# EAGLE design re design main board (EAGLE 7.7.0)
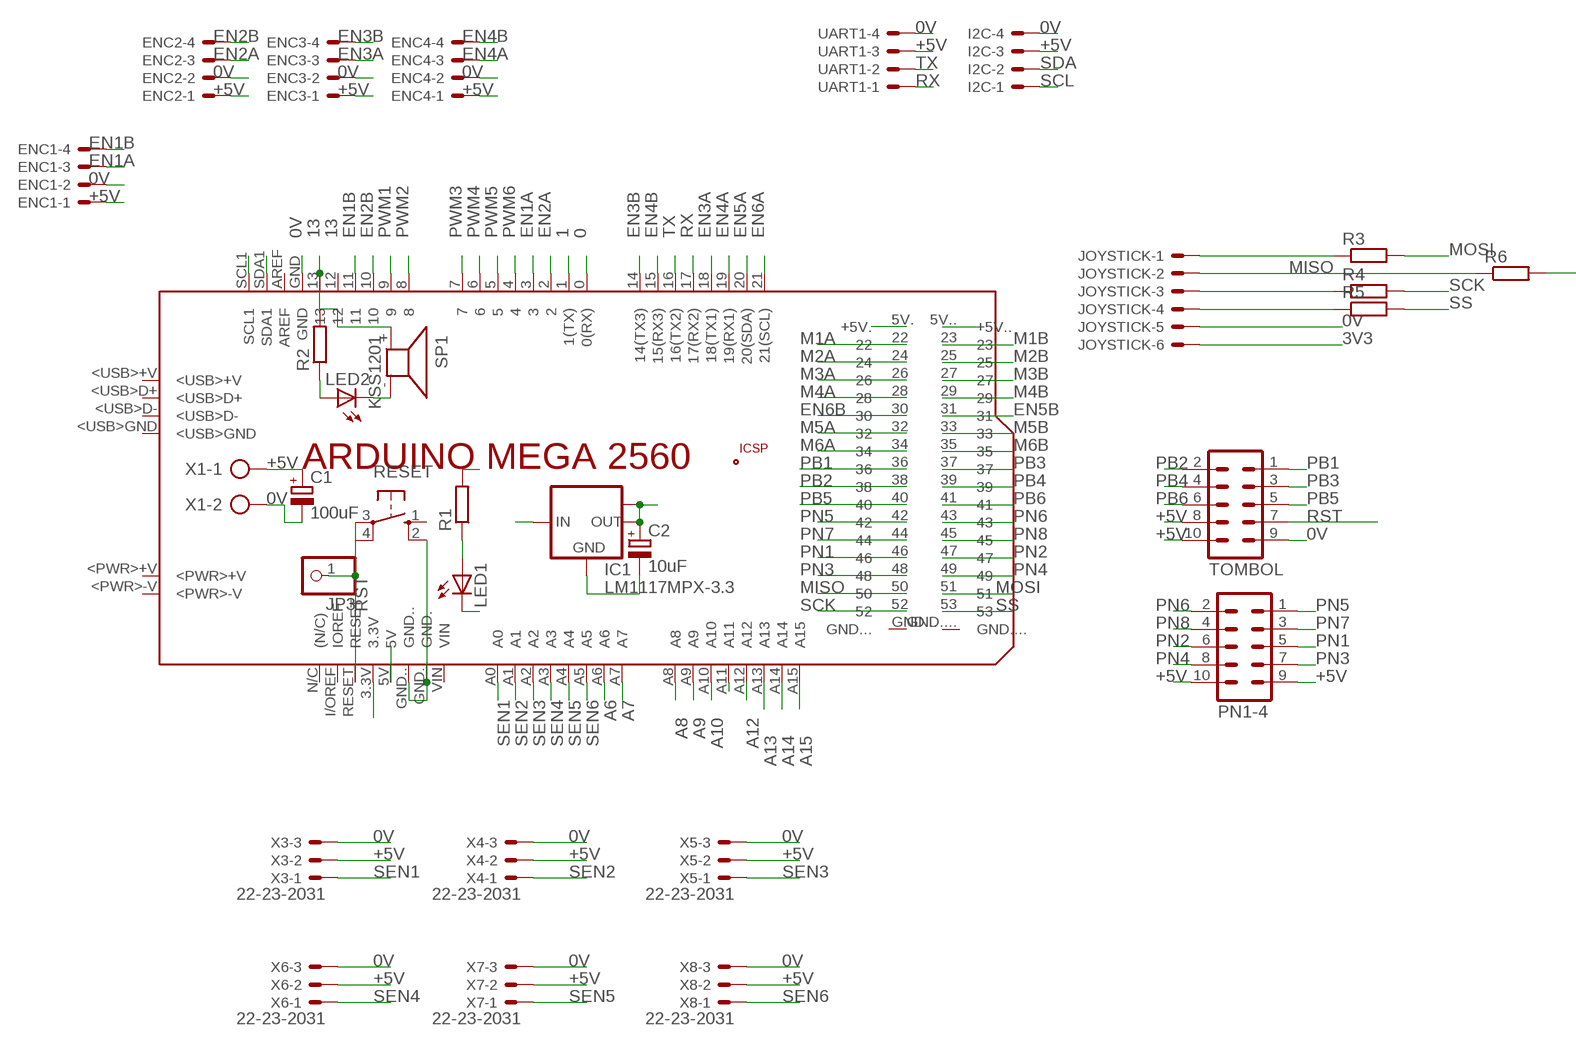
[diagram p0: schematic, sheet 1, part 1 of 2]
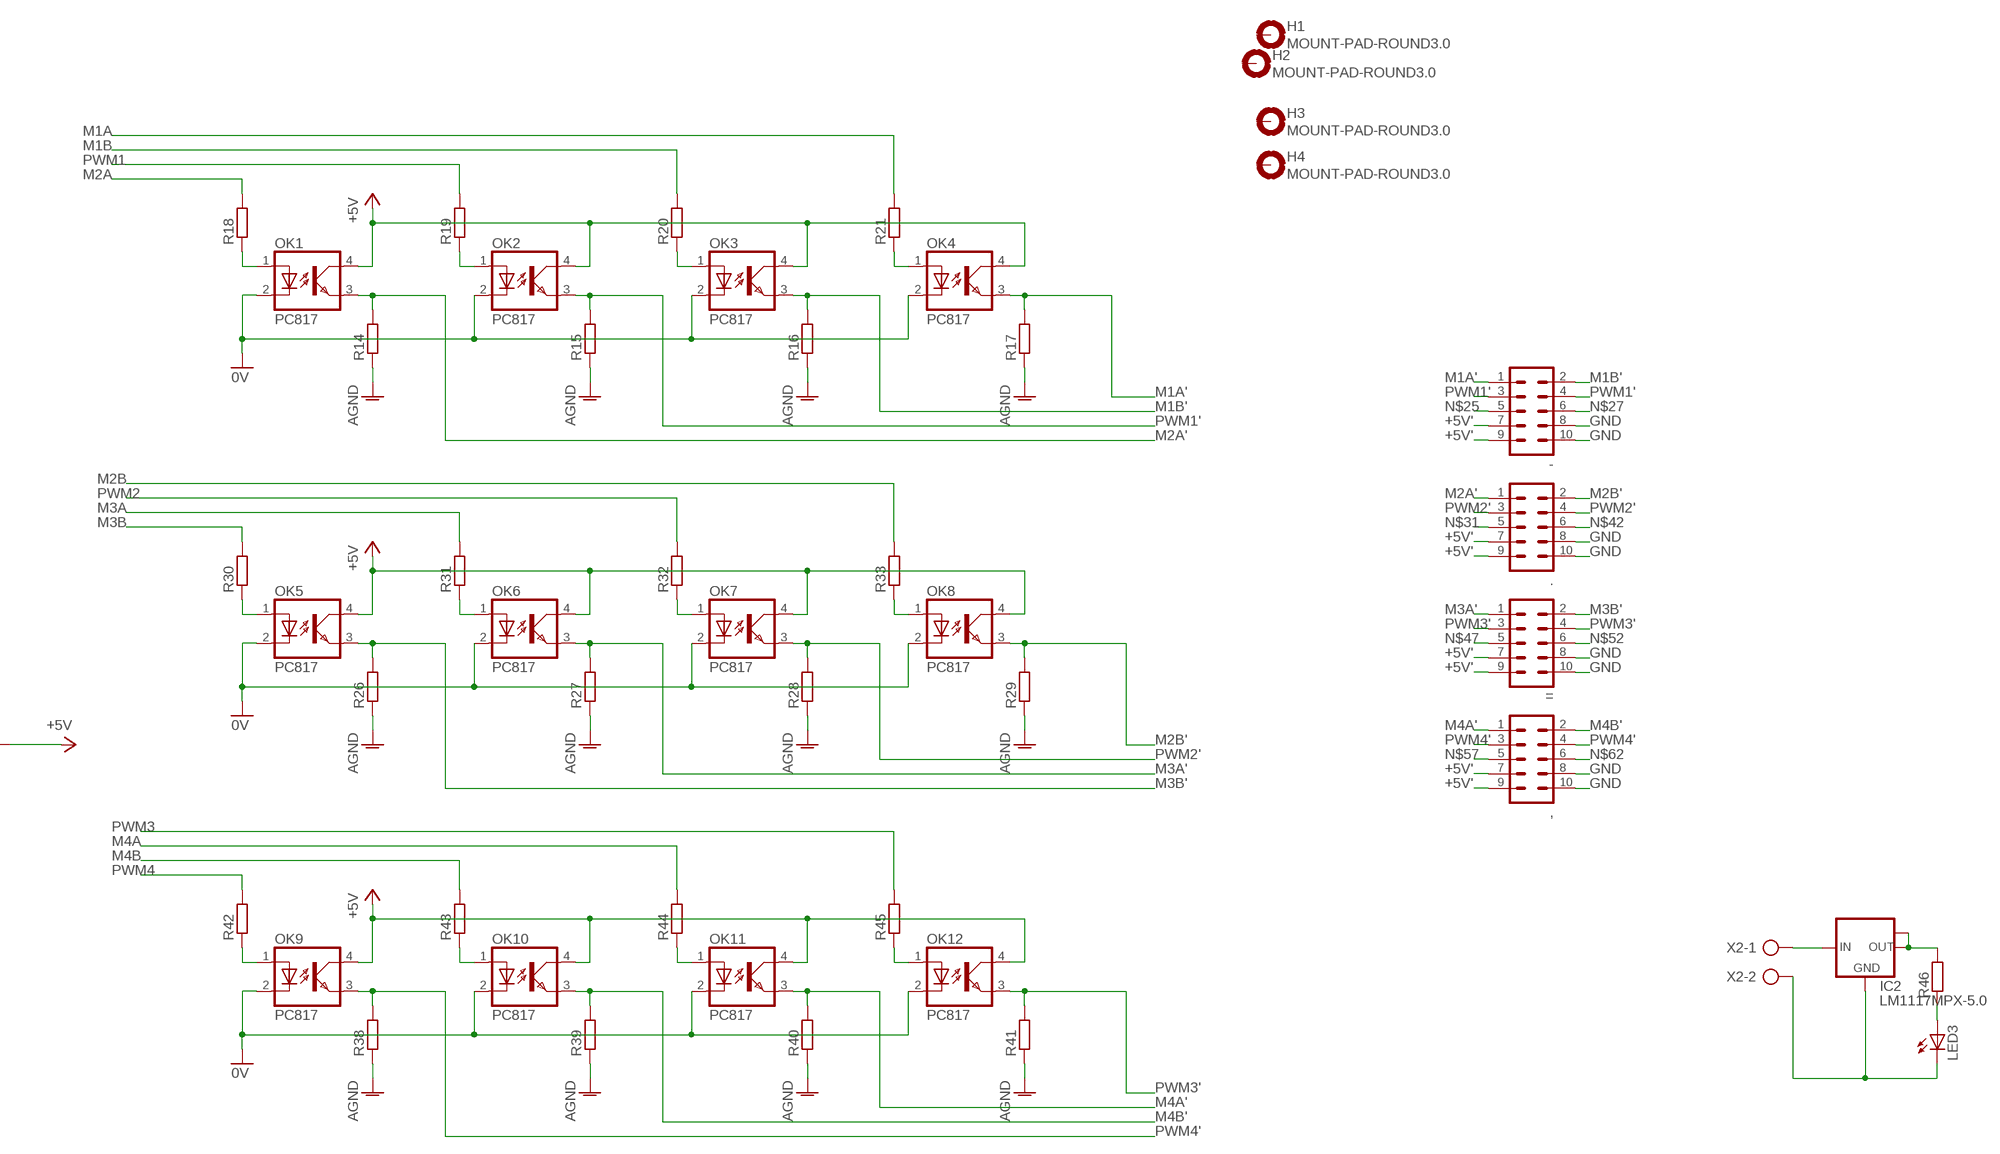
[diagram p1: schematic, sheet 1, part 2 of 2]

## Parts
,  ML10  [ML10]
-  ML10  [ML10]
.  ML10  [ML10]
=  ML10  [ML10]
C1  100uF  CPOL-EUE2.5-5  [E2,5-5]
C2  10uF  CPOL-EUE2.5-5  [E2,5-5]
ENC1  22-23-2041  [22-23-2041]
ENC2  22-23-2041  [22-23-2041]
ENC3  22-23-2041  [22-23-2041]
ENC4  22-23-2041  [22-23-2041]
H1  MOUNT-PAD-ROUND3.0  [3,0-PAD]
H2  MOUNT-PAD-ROUND3.0  [3,0-PAD]
H3  MOUNT-PAD-ROUND3.0  [3,0-PAD]
H4  MOUNT-PAD-ROUND3.0  [3,0-PAD]
I2C  22-23-2041  [22-23-2041]
IC1  LM1117MPX-3.3  [SOT223]
IC2  LM1117MPX-5.0  [SOT223]
JOYSTICK  22-23-2061  [22-23-2061]
JP3  PINHD-1X1  [1X01]
LED1  LED3MM  [LED3MM]
LED2  LED3MM  [LED3MM]
LED3  LED3MM  [LED3MM]
OK1  PC817  [DIL04]
OK2  PC817  [DIL04]
OK3  PC817  [DIL04]
OK4  PC817  [DIL04]
OK5  PC817  [DIL04]
OK6  PC817  [DIL04]
OK7  PC817  [DIL04]
OK8  PC817  [DIL04]
OK9  PC817  [DIL04]
OK10  PC817  [DIL04]
OK11  PC817  [DIL04]
OK12  PC817  [DIL04]
PCB1  ARDUINO_MEGA2560  [ARDUINO_MEGA2560]
PN1-4  ML10  [ML10]
R1  R-EU_M0805  [M0805]
R2  R-EU_M0805  [M0805]
R3  R-EU_R0805  [R0805]
R4  R-EU_R0805  [R0805]
R5  R-EU_R0805  [R0805]
R6  R-EU_R0805  [R0805]
R14  R-EU_M0805  [M0805]
R15  R-EU_M0805  [M0805]
R16  R-EU_M0805  [M0805]
R17  R-EU_M0805  [M0805]
R18  R-EU_M0805  [M0805]
R19  R-EU_M0805  [M0805]
R20  R-EU_M0805  [M0805]
R21  R-EU_M0805  [M0805]
R26  R-EU_M0805  [M0805]
R27  R-EU_M0805  [M0805]
R28  R-EU_M0805  [M0805]
R29  R-EU_M0805  [M0805]
R30  R-EU_M0805  [M0805]
R31  R-EU_M0805  [M0805]
R32  R-EU_M0805  [M0805]
R33  R-EU_M0805  [M0805]
R38  R-EU_M0805  [M0805]
R39  R-EU_M0805  [M0805]
R40  R-EU_M0805  [M0805]
R41  R-EU_M0805  [M0805]
R42  R-EU_M0805  [M0805]
R43  R-EU_M0805  [M0805]
R44  R-EU_M0805  [M0805]
R45  R-EU_M0805  [M0805]
R46  R-EU_0207/10  [0207/10]
RESET  40-XX  [B3F-40XX]
SP1  KSS1201  [KSS1201]
TOMBOL  ML10  [ML10]
UART1  22-23-2041  [22-23-2041]
X1  AK500/2  [AK500/2]
X2  AK300/2  [AK300/2]
X3  22-23-2031  [22-23-2031]
X4  22-23-2031  [22-23-2031]
X5  22-23-2031  [22-23-2031]
X6  22-23-2031  [22-23-2031]
X7  22-23-2031  [22-23-2031]
X8  22-23-2031  [22-23-2031]

## Nets
0: PCB1.0(0(RX))
0V: C1.- ENC1.2 ENC2.2 ENC3.2 ENC4.2 I2C.4 JOYSTICK.5 LED1.K(C) LED2.K(C) OK1.2(C) OK2.2(C) OK3.2(C) OK4.2(C) OK5.2(C) OK6.2(C) OK7.2(C) OK8.2(C) OK9.2(C) OK10.2(C) OK11.2(C) OK12.2(C) PCB1.GND PCB1.GND. PCB1.GND.. RESET.2(S1) SP1.- TOMBOL.9 UART1.4 X1.2 X3.3 X4.3 X5.3 X6.3 X7.3 X8.3
1: PCB1.1(1(TX))
3V3: C2.+ IC1.2(OUT) IC1.TAB(OUT1) JOYSTICK.6 PCB1.3.3V
13: PCB1.13 R2.2 SP1.+
+5V: C1.+ ENC1.1 ENC2.1 ENC3.1 ENC4.1 I2C.3 IC1.3(IN) PCB1.5V PCB1.5V.(+5V.) PCB1.5V..(+5V..) PN1-4.9 PN1-4.10 R1.2 R6.2 TOMBOL.8 TOMBOL.10 UART1.3 X1.1 X3.2 X4.2 X5.2 X6.2 X7.2 X8.2
+5V': ,.7 ,.9 -.7 -.9 ..7 ..9 =.7 =.9 IC2.2(OUT) IC2.TAB(OUT1) OK1.4(COL) OK2.4(COL) OK3.4(COL) OK4.4(COL) OK5.4(COL) OK6.4(COL) OK7.4(COL) OK8.4(COL) OK9.4(COL) OK10.4(COL) OK11.4(COL) OK12.4(COL) R46.2 ; supply symbol labelled +5V
A6: PCB1.A6
A7: PCB1.A7
A8: PCB1.A8
A9: PCB1.A9
A10: PCB1.A10
A11: PCB1.A11
A12: PCB1.A12
A13: PCB1.A13
A14: PCB1.A14
A15: PCB1.A15
EN1A: ENC1.3 PCB1.3
EN1B: ENC1.4 PCB1.11
EN2A: ENC2.3 PCB1.2
EN2B: ENC2.4 PCB1.10
EN3A: ENC3.3 PCB1.18(18(TX1))
EN3B: ENC3.4 PCB1.14(14(TX3))
EN4A: ENC4.3 PCB1.19(19(RX1))
EN4B: ENC4.4 PCB1.15(15(RX3))
EN5A: PCB1.20(20(SDA))
EN5B: PCB1.31
EN6A: PCB1.21(21(SCL))
EN6B: PCB1.30
GND: ,.8 ,.10 -.8 -.10 ..8 ..10 =.8 =.10 IC2.1(GND) LED3.K(C) R14.1 R15.1 R16.1 R17.1 R26.1 R27.1 R28.1 R29.1 R38.1 R39.1 R40.1 R41.1 X2.2 ; supply symbol labelled AGND
M1A: PCB1.22 R21.2
M1A': -.1 OK4.3(EMIT) R17.2
M1B: PCB1.23 R20.2
M1B': -.2 OK3.3(EMIT) R16.2
M2A: PCB1.24 R18.2
M2A': ..1 OK1.3(EMIT) R14.2
M2B: PCB1.25 R33.2
M2B': ..2 OK8.3(EMIT) R29.2
M3A: PCB1.26 R31.2
M3A': =.1 OK6.3(EMIT) R27.2
M3B: PCB1.27 R30.2
M3B': =.2 OK5.3(EMIT) R26.2
M4A: PCB1.28 R44.2
M4A': ,.1 OK11.3(EMIT) R40.2
M4B: PCB1.29 R43.2
M4B': ,.2 OK10.3(EMIT) R39.2
M5A: PCB1.32
M5B: PCB1.33
M6A: PCB1.34
M6B: PCB1.35
MISO: JOYSTICK.2 PCB1.50 R6.1
MOSI: PCB1.51 R3.2
N$3: LED1.A R1.1
N$4: LED2.A R2.1
N$6: C2.- IC1.1(GND)
N$9: OK1.1(A) R18.1
N$10: OK2.1(A) R19.1
N$11: OK3.1(A) R20.1
N$12: OK4.1(A) R21.1
N$18: OK5.1(A) R30.1
N$19: OK6.1(A) R31.1
N$20: OK7.1(A) R32.1
N$21: OK8.1(A) R33.1
N$23: JOYSTICK.1 R3.1
N$25: -.5
N$26: JOYSTICK.3 R4.1
N$27: -.6
N$28: JOYSTICK.4 R5.1
N$29: LED3.A R46.1
N$30: IC2.3(IN) X2.1
N$31: ..5
N$37: OK9.1(A) R42.1
N$38: OK10.1(A) R43.1
N$39: OK11.1(A) R44.1
N$40: OK12.1(A) R45.1
N$42: ..6
N$47: =.5
N$52: =.6
N$57: ,.5
N$62: ,.6
PB1: PCB1.36 TOMBOL.1
PB2: PCB1.38 TOMBOL.2
PB3: PCB1.37 TOMBOL.3
PB4: PCB1.39 TOMBOL.4
PB5: PCB1.40 TOMBOL.5
PB6: PCB1.41 TOMBOL.6
PN1: PCB1.46 PN1-4.5
PN2: PCB1.47 PN1-4.6
PN3: PCB1.48 PN1-4.7
PN4: PCB1.49 PN1-4.8
PN5: PCB1.42 PN1-4.1
PN6: PCB1.43 PN1-4.2
PN7: PCB1.44 PN1-4.3
PN8: PCB1.45 PN1-4.4
PWM1: PCB1.9 R19.2
PWM1': -.3 -.4 OK2.3(EMIT) R15.2
PWM2: PCB1.8 R32.2
PWM2': ..3 ..4 OK7.3(EMIT) R28.2
PWM3: PCB1.7 R45.2
PWM3': =.3 =.4 OK12.3(EMIT) R41.2
PWM4: PCB1.6 R42.2
PWM4': ,.3 ,.4 OK9.3(EMIT) R38.2
PWM5: PCB1.5
PWM6: PCB1.4
RST: JP3.1 PCB1.RESET RESET.3(P) TOMBOL.7
RX: PCB1.17(17(RX2)) UART1.1
SCK: PCB1.52 R4.2
SCL: I2C.1 PCB1.SCL1
SDA: I2C.2 PCB1.SDA1
SEN1: PCB1.A0 X3.1
SEN2: PCB1.A1 X4.1
SEN3: PCB1.A2 X5.1
SEN4: PCB1.A3 X6.1
SEN5: PCB1.A4 X7.1
SEN6: PCB1.A5 X8.1
SS: PCB1.53 R5.2
TX: PCB1.16(16(TX2)) UART1.2
Unconnected: H1.B3,0(MOUNT) H2.B3,0(MOUNT) H3.B3,0(MOUNT) H4.B3,0(MOUNT) PCB1.12 PCB1.<PWR>+V PCB1.<PWR>-V PCB1.<USB>+V PCB1.<USB>D+ PCB1.<USB>D- PCB1.<USB>GND PCB1.AREF PCB1.GND... PCB1.GND.... PCB1.I/OREF(IOREF) PCB1.N/C((N/C)) PCB1.VIN RESET.1(S) RESET.4(P1)

## Library data of the parts
, - . = PN1-4 TOMBOL = con-harting-ml:ML10: HARTING; OC_FARNELL: unknown; OC_NEWARK: unknown
C1 C2 = rcl:CPOL-EU: POLARIZED CAPACITOR, European symbol
ENC1-ENC4 I2C UART1 = con-molex:22-23-2041: .100" (2.54mm) Center Header - 4 Pin; MF: MOLEX; MPN: 22-23-2041; OC_FARNELL: 1462920; OC_NEWARK: 38C0355
H1-H4 = holes:MOUNT-PAD-ROUND: MOUNTING PAD, round
IC1 IC2 = lm1117:LM1117MPX-*
JOYSTICK = con-molex:22-23-2061: .100" (2.54mm) Center Header - 6 Pin; MF: MOLEX; MPN: 22-23-2061; OC_FARNELL: 1462922; OC_NEWARK: 27C1933
JP3 = pinhead:PINHD-1X1: PIN HEADER
LED1-LED3 = led:LED: LED OSRAM: - CHIPLED LG R971, LG N971, LY N971, LG Q971, LY Q971, LO R971, LY R971 LH N974, LH R974 LS Q976, LO Q976, LY Q976 LO Q996 - Hyper CHIPLED LW Q18S LB Q993, LB Q99A, LB R99A - SideLED LS A670, LO A670, LY A670, LG A670, LP A670 LB A673, LV A673, LT A673, LW A673 LH A674 LY A675 LS A676, LA A676, LO A676, LY A676, LW A676 LS A679, LY A679, LG A679 - Hyper Micro SIDELED® LS Y876, LA Y876, LO Y876, LY Y876 LT Y87S - SmartLED LW L88C, LW L88S LB L89C, LB L89S, LG L890 LS L89K, LO L89K, LY L89K LS L896, LA L896, LO L896, LY L896 - TOPLED LS T670, LO T670, LY T670, LG T670, LP T670 LSG T670, LSP T670, LSY T670, LOP T670, LYG T670 LG T671, LOG T671, LSG T671 LB T673, LV T673, LT T673, LW T673 LH T674 LS T676, LA T676, LO T676, LY T676, LB T676, LH T676, LSB T676, LW T676 LB T67C, LV T67C, LT T67C, LS T67K, LO T67K, LY T67K, LW E67C LS E67B, LA E67B, LO E67B, LY E67B, LB E67C, LV E67C, LT E67C LW T67C LS T679, LY T679, LG T679 LS T770, LO T770, LY T770, LG T770, LP T770 LB T773, LV T773, LT T773, LW T773 LH T774 LS E675, LA E675, LY E675, LS T675 LS T776, LA T776, LO T776, LY T776, LB T776 LHGB T686 LT T68C, LB T68C - Hyper Mini TOPLED® LB M676 - Mini TOPLED Santana® LG M470 LS M47K, LO M47K, LY M47K Source: http://www.osram.convergy.de LUXEON: - LUMILED® LXK2-PW12-R00, LXK2-PW12-S00, LXK2-PW14-U00, LXK2-PW14-V00 LXK2-PM12-R00, LXK2-PM12-S00, LXK2-PM14-U00 LXK2-PE12-Q00, LXK2-PE12-R00, LXK2-PE12-S00, LXK2-PE14-T00, LXK2-PE14-U00 LXK2-PB12-K00, LXK2-PB12-L00, LXK2-PB12-M00, LXK2-PB14-N00, LXK2-PB14-P00, LXK2-PB14-Q00 LXK2-PR12-L00, LXK2-PR12-M00, LXK2-PR14-Q00, LXK2-PR14-R00 LXK2-PD12-Q00, LXK2-PD12-R00, LXK2-PD12-S00 LXK2-PH12-R00, LXK2-PH12-S00 LXK2-PL12-P00, LXK2-PL12-Q00, LXK2-PL12-R00 Source: www.luxeon.com KINGBRIGHT: KA-3528ASYC Source: www.kingbright.com
OK1-OK12 = optocoupler:PC817: SHARP OPTO COUPLER; MPN: PC817X4J000F; OC_FARNELL: 9707727; OC_NEWARK: 97K7059
PCB1 = Arduino:ARDUINO_MEGA2560: Device for representing an Arduino Mega 2560 board with a footprint in an EAGLE design. Created by Dave Young for Element14. More EAGLE documentation at: http://www.element14.com/community/community/knode/cadsoft_eagle
R1-R6 R14-R21 R26-R33 R38-R46 = rcl:R-EU_: RESISTOR, European symbol
RESET = switch-omron:40-XX: OMRON SWITCH; MF: OMRON COMPONENTS USA; MPN: B3F-4000; OC_FARNELL: 176434; OC_NEWARK: 36K3105
SP1 = buzzer:KSS1201: SPEAKER Source: Schukat; OC_FARNELL: unknown; OC_NEWARK: unknown
X1 = con-ptr500:AK500/2: CONNECTOR; OC_FARNELL: unknown; OC_NEWARK: unknown
X2 = con-ptr500:AK300/2: CONNECTOR; OC_FARNELL: unknown; OC_NEWARK: unknown
X3-X8 = con-molex:22-23-2031: .100" (2.54mm) Center Header - 3 Pin; MF: MOLEX; MPN: 22-23-2031; OC_FARNELL: 1462950; OC_NEWARK: 30C0862

## Board
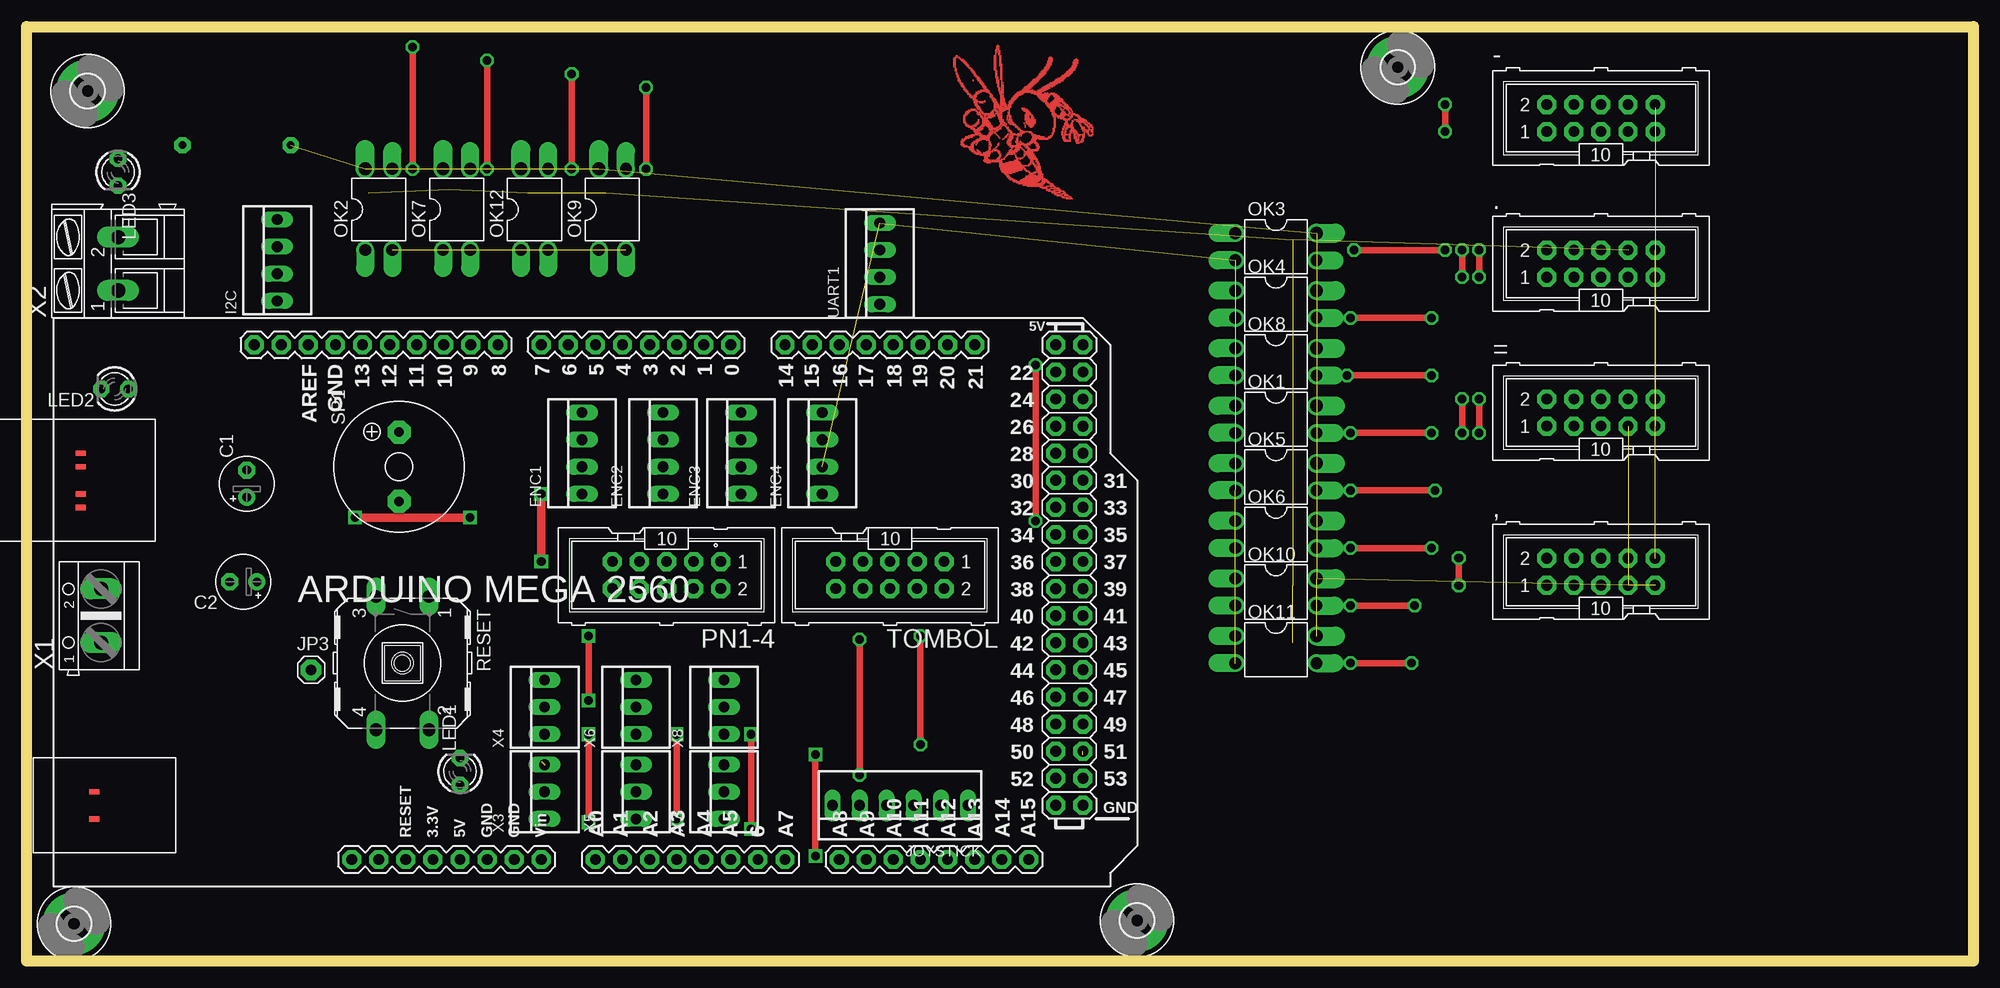
[diagram p2: board, top side]
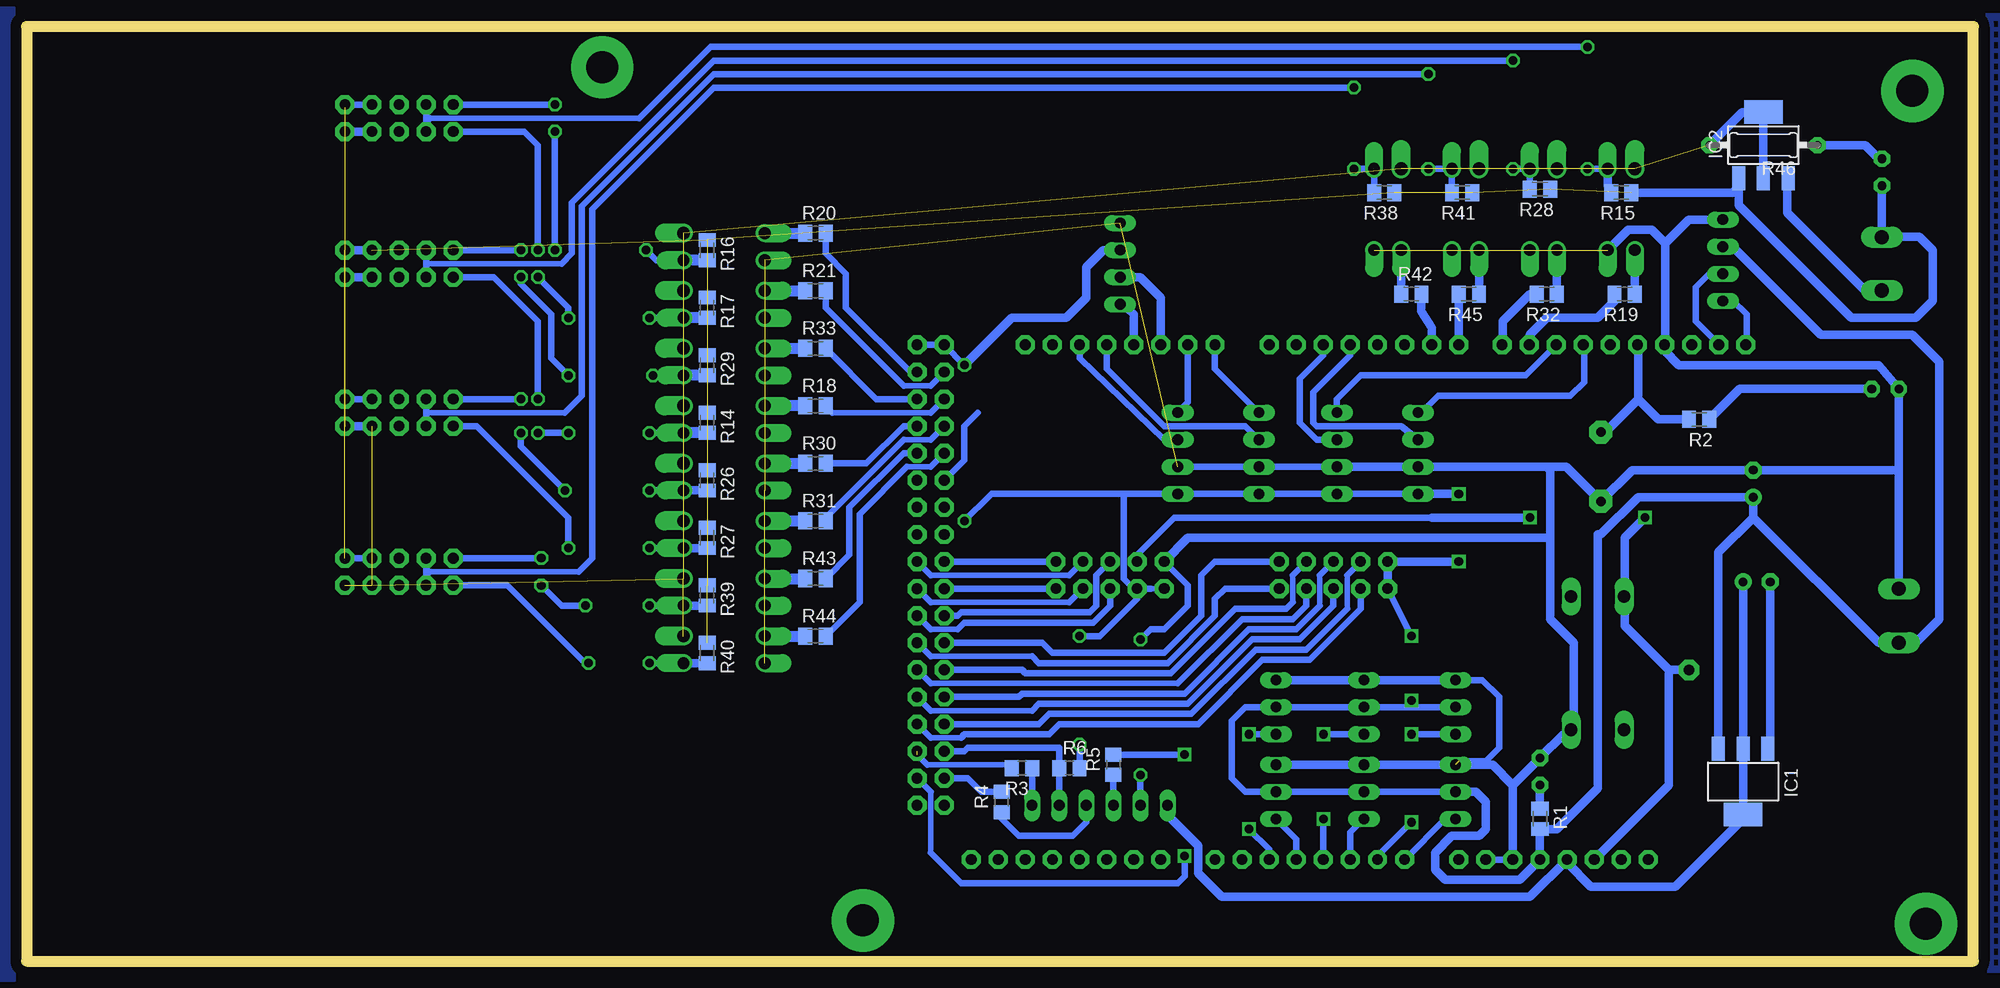
[diagram p3: board, bottom side, seen from below]

Size 182.56 x 87.63 mm. Coordinates in mm from the lower left corner, seen from the top.
Outline: 0,87.63 182.56,87.63 182.56,0 0,0 0,87.63
Copper layers (1*16): Top 0.035mm / dielectric 1.5mm / Bottom 0.035mm
Design rules "default": minimum track width 10mil, minimum drill 24mil, track to track 8mil, track to pad 8mil, pad to pad 8mil, via to via 8mil, smd to smd 8mil, copper to edge 40mil, drill to drill 8mil, minimum pad ring 10mil, minimum via ring 8mil, stop-mask expansion 4mil, vias tented up to drill 0mil, thermal gap 10mil

### Footprints (pad centres in the part's own frame; a part is rotated, then mirrored left to right if it is on the bottom)
ML10 = drill 1 pad 1.778 octagon: 1 -5.08,-1.27; 2 -5.08,1.27; 3 -2.54,-1.27; 4 -2.54,1.27; 5 0,-1.27; 6 0,1.27; 7 2.54,-1.27; 8 2.54,1.27; 9 5.08,-1.27; 10 5.08,1.27
E2,5-5 = drill 0.813 pad 1.6: + -1.27,0 | drill 0.813 pad 1.6 octagon: - 1.27,0
22-23-2041 = drill 1 long: 1 -3.81,0; 2 -1.27,0; 3 1.27,0; 4 3.81,0
3,0-PAD = drill 3 pad 5.842: B3,0 0,0
SOT223 = smd 1.219 x 2.235: 1 -2.311,-3.099; 2 0,-3.099; 3 2.311,-3.099 | smd 3.6 x 2.2: TAB 0,3.099
22-23-2061 = drill 1 long: 1 -6.35,0; 2 -3.81,0; 3 -1.27,0; 4 1.27,0; 5 3.81,0; 6 6.35,0
1X01 = drill 1 pad 1.93 octagon: 1 0,0
LED3MM = drill 0.813 pad 1.524 octagon: A -1.27,0; K 1.27,0
DIL04 = drill 1.1 pad 1.676 offset: 1 -1.27,-3.81; 2 1.27,-3.81; 3 1.27,3.81 | drill 1.2 pad 1.676 offset: 4 -1.27,3.81
ARDUINO_MEGA2560 = drill 1.016 pad 1.778 octagon: 0 63.5,50.8; 1 60.96,50.8; 2 58.42,50.8; 3 55.88,50.8; 3.3V 35.56,2.54; 4 53.34,50.8; 5 50.8,50.8; 5V 38.1,2.54; 5V. 93.98,50.8; 5V.. 96.52,50.8; 6 48.26,50.8; 7 45.72,50.8; 8 41.656,50.8; 9 39.116,50.8; 10 36.576,50.8; 11 34.036,50.8; 12 31.496,50.8; 13 28.956,50.8; 14 68.58,50.8; 15 71.12,50.8; 16 73.66,50.8; 17 76.2,50.8; 18 78.74,50.8; 19 81.28,50.8; 20 83.82,50.8; 21 86.36,50.8; 22 93.98,48.26; 23 96.52,48.26; 24 93.98,45.72; 25 96.52,45.72; 26 93.98,43.18; 27 96.52,43.18; 28 93.98,40.64; 29 96.52,40.64; 30 93.98,38.1; 31 96.52,38.1; 32 93.98,35.56; 33 96.52,35.56; 34 93.98,33.02; 35 96.52,33.02; 36 93.98,30.48; 37 96.52,30.48; 38 93.98,27.94; 39 96.52,27.94; 40 93.98,25.4; 41 96.52,25.4; 42 93.98,22.86; 43 96.52,22.86; 44 93.98,20.32; 45 96.52,20.32; 46 93.98,17.78; 47 96.52,17.78; 48 93.98,15.24; 49 96.52,15.24; 50 93.98,12.7; 51 96.52,12.7; 52 93.98,10.16; 53 96.52,10.16; A0 50.8,2.54; A1 53.34,2.54; A2 55.88,2.54; A3 58.42,2.54; A4 60.96,2.54; A5 63.5,2.54; A6 66.04,2.54; A7 68.58,2.54; A8 73.66,2.54; A9 76.2,2.54; A10 78.74,2.54; A11 81.28,2.54; A12 83.82,2.54; A13 86.36,2.54; A14 88.9,2.54; A15 91.44,2.54; AREF 23.876,50.8; GND 26.416,50.8; GND. 43.18,2.54; GND.. 40.64,2.54; GND... 93.98,7.62; GND.... 96.52,7.62; I/OREF 30.48,2.54; N/C 27.94,2.54; RESET 33.02,2.54; SCL1 18.796,50.8; SDA1 21.336,50.8; VIN 45.72,2.54 | smd 1.016 x 0.508: <PWR>+V 3.81,8.89; <PWR>-V 3.81,6.35; <USB>+V 2.54,40.64; <USB>D+ 2.54,39.37; <USB>D- 2.54,36.83; <USB>GND 2.54,35.56
M0805 = smd 1.3 x 1.6: 1 -0.95,0; 2 0.95,0
R0805 = smd 1.3 x 1.5: 1 -0.95,0; 2 0.95,0
0207/10 = drill 0.7 pad 1.524 octagon: 1 -5.08,0; 2 5.08,0
B3F-40XX = drill 1.194 long: 1 -6.248,2.489; 2 6.248,2.489; 3 -6.248,-2.489; 4 6.248,-2.489
KSS1201 = drill 0.914 pad 2.159 octagon: + 3.251,0; - -3.251,0
AK500/2 = drill 1.321 long: 1 -2.515,0; 2 2.515,0
AK300/2 = drill 1.321 long: 1 -2.515,0; 2 2.489,0
22-23-2031 = drill 1 long: 1 -2.54,0; 2 0,0; 3 2.54,0

### Placement (x,y rotation side)
,  147.64,36.51 0 top
-  147.64,79.06 0 top
.  147.64,65.41 0 top
=  147.64,51.44 0 top
C1  20.64,44.77 90 top
C2  20.32,35.56 180 top
ENC1  52.07,47.62 90 top
ENC2  59.69,47.62 90 top
ENC3  66.99,47.62 90 top
ENC4  74.61,47.62 90 top
H1  5.72,81.6 180 top
H2  128.59,83.82 0 top
H3  104.14,3.81 0 top
H4  4.45,3.49 0 top
I2C  23.5,65.72 90 top
IC1  21.59,16.83 180 bottom
IC2  19.69,76.52 0 bottom
JOYSTICK  81.91,14.61 180 top
JP3  26.67,27.3 0 top
LED1  40.64,17.78 90 top
LED2  8.26,53.66 180 top
LED3  8.57,73.98 270 top
OK1  117.16,50.8 270 top
OK2  33.02,70.48 0 top
OK3  117.16,66.99 270 top
OK4  117.16,61.6 270 top
OK5  117.16,45.4 270 top
OK6  117.16,40.01 270 top
OK7  40.32,70.48 0 top
OK8  117.16,56.2 270 top
OK9  54.93,70.48 0 top
OK10  117.16,34.61 270 top
OK11  117.16,29.21 270 top
OK12  47.62,70.48 0 top
PCB1  2.54,6.99 0 top
PN1-4  60.01,36.2 180 top
R1  40.64,13.33 270 bottom
R2  25.72,50.8 180 bottom
R3  89.22,18.1 180 bottom
R4  91.12,14.92 90 bottom
R5  80.65,18.41 90 bottom
R6  84.77,18.1 0 bottom
R14  118.75,50.48 270 bottom
R15  33.02,72.07 180 bottom
R16  118.75,66.67 270 bottom
R17  118.75,61.28 270 bottom
R18  108.59,52.07 0 bottom
R19  32.7,62.55 180 bottom
R20  108.59,68.26 0 bottom
R21  108.59,62.87 0 bottom
R26  118.75,45.09 270 bottom
R27  118.75,39.69 270 bottom
R28  40.64,72.39 180 bottom
R29  118.75,55.88 270 bottom
R30  108.59,46.67 0 bottom
R31  108.59,41.28 0 bottom
R32  40,62.55 180 bottom
R33  108.59,57.47 0 bottom
R38  55.25,72.07 180 bottom
R39  118.75,34.29 270 bottom
R40  118.75,28.89 270 bottom
R41  47.94,72.07 180 bottom
R42  52.71,62.55 0 bottom
R43  108.59,35.88 0 bottom
R44  108.59,30.48 0 bottom
R45  47.31,62.55 180 bottom
R46  19.69,76.52 180 bottom
RESET  35.24,27.94 270 top
SP1  34.92,46.36 90 top
TOMBOL  80.96,36.2 180 top
UART1  80.01,65.41 90 top
X1  6.98,32.39 90 top
X2  8.57,65.41 90 top
X3  48.58,15.88 90 top
X4  48.58,23.81 90 top
X5  57.15,15.88 90 top
X6  57.15,23.81 90 top
X7  65.41,15.88 90 top
X8  65.41,23.81 90 top

### Tracks (layer width: path | path; a pad name or v marks a point on that pad's centre or on a via)
0V  (via drill 0.8 pad 1.27)  (13 unrouted)
  Top 0.61: v78.1,30.16 v78.1,17.46
  Bottom 0.61: ENC4.2 ENC3.2 ENC2.2 | 42.86,9.21 PCB1.GND.. PCB1.GND. | TOMBOL.9 73.66,35.24 73.66,33.34 75.88,31.11 77.15,31.11 v78.1,30.16 | v78.1,17.46 JOYSTICK.5 | X4.3 46.04,26.35 44.45,24.76 44.45,20 45.72,18.73 48.26,18.73
  Bottom 0.813: OK2.2 32.39,68.58 30.16,68.58 28.89,67.31 | 28.89,67.31 28.89,57.85 PCB1.GND 28.96,57.21 27.62,55.88 8.89,55.88 LED2.K 6.98,46.04 | I2C.4 26.67,69.53 28.89,67.31 | 37.47,21.43 37.47,29.85 39.69,32.07 39.69,39.69 | 37.47,21.43 37.47,21.27 38.42,21.27 LED1.K 40.96,19.05 40.96,18.73 43.18,16.51 | 37.47,21.43 RESET.2 | 43.18,16.51 PCB1.GND.. | X1.2 6.98,46.04 | 6.98,46.04 C1.- 31.99,46.04 SP1.- 38.18,46.36 40,46.36 | ENC2.2 ENC1.2 40,46.36 | 39.69,39.69 73.66,39.69 TOMBOL.9 | X8.3 X6.3 X4.3 | 43.18,16.51 45.09,18.41 X3.3 X5.3 X7.3 | 39.69,39.69 39.69,46.04 40,46.36
  pour Bottom (isolate 0.8, hatched): -1.13,88.68 -13.83,88.68 -13.53,-1.02 -1.13,-0.92
3V3
  Bottom 0.813: JOYSTICK.6 75.56,13.65 72.71,10.79 72.71,8.25 70.49,6.03 41.59,6.03 PCB1.3.3V 38.1,9.21 35.88,6.99 27.94,6.99 21.59,13.33 IC1.TAB IC1.2 C2.+
13
  Bottom 0.813: SP1.+ 34.53,49.61 31.43,52.71 | 31.43,52.71 31.43,57.72 PCB1.13 | R2.2 29.53,50.8 31.43,52.71
+5V  (via drill 0.8 pad 1.27)
  Top 0.61: v94.62,41.28 v94.62,55.88 | v83.82,30.48 v83.82,20.32 | v52.71,30.48 v52.71,24.45
  Top 0.813: v48.26,37.47 v48.26,43.82
  Bottom 0.51: TOMBOL.10 77.15,34.93 TOMBOL.8
  Bottom 0.61: v94.62,41.28 92.24,43.65 92.08,43.82 79.69,43.82 | v94.62,55.88 PCB1.5V. PCB1.5V.. | 79.69,43.82 ENC4.1 ENC3.1 ENC2.1 ENC1.1 | TOMBOL.10 75.88,35.24 | TOMBOL.8 78.42,33.97 81.91,30.48 v83.82,30.48 | v83.82,20.32 R6.2 | 52.71,23.81 X6.2 X8.2 68.26,23.81 69.53,22.54 69.53,17.14 68.26,15.88 X7.2 X5.2 X3.2 | 52.71,23.81 X4.2 | PN1-4.10 v52.71,30.48 | v52.71,24.45 52.71,23.81 | 77.15,34.93 78.74,34.93 79.69,35.88 79.69,43.82
  Bottom 0.813: UART1.3 81.6,66.67 83.19,65.09 83.19,62.23 85.09,60.32 90.17,60.32 v94.62,55.88 | 20.64,41.59 8.89,29.85 8.26,29.85 8.23,29.87 X1.1 6.96,29.85 5.4,29.85 3.17,32.07 3.17,56.2 5.72,58.74 14.29,58.74 22.54,66.99 I2C.3 | 20.64,41.59 C1.+ 31.43,43.5 34.92,40.01 35.24,40.01 35.24,16.19 39.05,12.38 R1.2 PCB1.5V 42.55,7.62 49.53,7.62 50.48,8.57 50.48,10.16 48.9,11.75 46.35,11.75 45.72,12.38 45.72,14.92 46.67,15.88 X3.2 | IC1.3 23.9,38.33 20.64,41.59 | PN1-4.10 PN1-4.9 v48.26,37.47 | v48.26,43.82 ENC1.1
+5V'  (17 unrouted)
  Bottom 0.813: ..7 ..9 | =.9 =.7 | -.7 -.9 | R46.2 21.67,79.62 IC2.TAB IC2.2
EN1A
  Bottom 0.61: ENC1.3 53.66,50.16 61.59,50.16 61.91,50.48 61.91,53.34 58.42,56.83 PCB1.3
EN1B
  Bottom 0.61: PCB1.11 36.51,57.72 36.51,54.29 37.78,53.02 50.16,53.02 51.75,51.44 ENC1.4
EN2A
  Bottom 0.61: ENC2.3 61.59,48.9 63.18,50.48 63.18,54.61 60.96,56.83 PCB1.2
EN2B
  Bottom 0.61: PCB1.10 41.97,54.93 57.47,54.93 59.69,52.71 ENC2.4
EN3A
  Bottom 0.61: ENC3.3 68.26,50.16 75.88,50.16 81.28,55.56 PCB1.18
EN3B
  Bottom 0.61: ENC3.4 71.12,55.56 PCB1.14
EN4A
  Bottom 0.61: ENC4.3 75.88,48.9 83.82,56.52 PCB1.19
EN4B
  Bottom 0.61: ENC4.4 73.66,52.39 PCB1.15
EN6B
  Bottom 0.61: PCB1.30 94.62,46.99 94.62,50.16 93.34,51.44
GND  (15 unrouted)
  Bottom 0.61: ,.8 ,.10 | =.8 =.10 | -.8 -.10
  Bottom 0.813: 152.72,80.01 -.10 | ..10 ..8 | LED3.K X2.2 8.52,67.94 5.08,67.94 3.81,66.67 3.81,61.91 5.4,60.32 11.43,60.32 22,70.89 22,72.62 | IC2.1 22,72.62 | 22,72.62 22.54,72.07 R15.1
  pour Bottom (isolate 0.8): 183.66,88.98 205.47,88.98 205.47,-1.72 183.66,-1.42
M1A
  Bottom 0.508: 97.79,53.98 100.33,53.98
  Bottom 0.61: PCB1.22 97.79,53.98 | 100.33,53.98 107.63,61.28 R21.2
M1A'  (via drill 0.8 pad 1.27)
  Top 0.61: v124.14,60.32 v131.76,60.32 | v134.62,64.13 v134.62,66.67
  Bottom 0.61: OK4.3 v124.14,60.32 | v134.62,66.67 134.62,76.52 135.89,77.79 -.1 | v134.62,64.13 131.76,61.28 v131.76,60.32
  Bottom 1.016: R17.2 OK4.3
M1B
  Bottom 0.61: PCB1.23 99.69,55.25 105.73,61.28 105.73,64.45 107.63,66.36 R20.2
M1B'  (via drill 0.8 pad 1.27)
  Top 0.61: v124.46,66.67 v133.03,66.67 | v133.03,77.79 v133.03,80.33
  Bottom 0.61: OK3.3 123.51,65.72 v124.46,66.67 | v133.03,66.67 v133.03,77.79 | v133.03,80.33 -.2
  Bottom 1.016: R16.2 OK3.3
M2A
  Bottom 0.508: 97.79,51.44 107,51.44
  Bottom 0.61: PCB1.24 97.79,51.44 | 107,51.44 R18.2
M2A'  (via drill 0.8 pad 1.27)
  Top 0.61: v124.14,49.53 v131.76,49.53 | v134.62,49.53 v134.62,52.71
  Bottom 0.61: OK1.3 v124.14,49.53 | v131.76,49.53 v134.62,49.53 | v134.62,52.71 134.62,60.01 138.75,64.13 ..1
  Bottom 1.016: R14.2 OK1.3
M2B
  Bottom 0.61: PCB1.25 102.87,52.71 R33.2
M2B'  (via drill 0.8 pad 1.27)
  Top 0.61: v123.83,54.93 v131.76,54.93 | v136.21,64.13 v136.21,66.67
  Bottom 0.61: OK8.3 v123.83,54.93 | v131.76,54.93 133.35,56.52 133.35,60.64 136.21,63.5 v136.21,64.13 | v136.21,66.67 ..2
  Bottom 1.016: R29.2 OK8.3
M3A
  Bottom 0.508: 100.33,48.9 97.79,48.9
  Bottom 0.61: R31.2 107.63,41.59 100.33,48.9 | 97.79,48.9 PCB1.26
M3A'  (via drill 0.8 pad 1.27)
  Top 0.61: v124.14,38.73 v131.76,38.73
  Bottom 0.61: OK6.3 v124.14,38.73 | v131.76,38.73 131.76,41.59 140.34,50.16 =.1
  Bottom 0.813: R27.2 OK6.3
M3B
  Bottom 0.61: R30.2 103.82,46.67 100.33,50.16 PCB1.27
M3B'  (via drill 0.8 pad 1.27)
  Top 0.61: v124.14,44.13 v132.08,44.13 | v136.21,49.53 v136.21,52.71
  Bottom 0.61: OK5.3 v124.14,44.13 | v132.08,44.13 136.21,48.26 v136.21,49.53 | v136.21,52.71 =.2
  Bottom 0.813: R26.2 OK5.3
M4A
  Bottom 0.508: 100.01,46.36 97.79,46.36
  Bottom 0.61: R44.2 104.46,33.66 104.46,41.91 100.01,46.36 | 97.79,46.36 PCB1.28
M4A'  (via drill 0.8 pad 1.27)
  Top 0.61: v124.14,27.94 v129.86,27.94
  Bottom 0.61: OK11.3 v124.14,27.94 | v129.86,27.94 130.18,27.94 137.48,35.24 ,.1
  Bottom 0.813: OK11.3 R40.2
M4B
  Bottom 0.61: R43.2 105.41,38.1 105.41,42.55 100.33,47.62 PCB1.29
M4B'  (via drill 0.8 pad 1.27)
  Top 0.61: v124.14,33.34 v130.18,33.34 | v134.3,35.24 v134.3,37.78
  Bottom 0.61: OK10.3 v124.14,33.34 | v130.18,33.34 132.4,33.34 v134.3,35.24 | v134.3,37.78 ,.2
  Bottom 0.813: R39.2 OK10.3
MISO
  Bottom 0.61: JOYSTICK.2 R6.1 85.72,20 94.3,20 94.62,19.68 PCB1.50
MOSI  (1 unrouted)
  Bottom 0.508: 98.11,18.41 90.49,18.41
  Bottom 0.61: 99.06,19.37 98.11,18.41 | 90.49,18.41 R3.2
N$3
  Bottom 0.813: LED1.A R1.1
N$4
  Bottom 0.813: LED2.A 21.91,53.66 R2.1
N$6
  Bottom 0.813: C2.- 19.05,20.16 IC1.1
N$9
  Bottom 1.016: R18.1 OK1.1
N$10
  Bottom 0.813: OK2.1 R19.1
N$11
  Bottom 1.016: OK3.1 R20.1
N$12
  Bottom 1.016: OK4.1 R21.1
N$18
  Bottom 1.016: OK5.1 R30.1
N$19
  Bottom 1.016: OK6.1 R31.1
N$20
  Bottom 0.813: OK7.1 R32.1
N$21
  Bottom 1.016: OK8.1 R33.1
N$23
  Bottom 0.61: R3.1 JOYSTICK.1
N$26
  Bottom 0.61: R4.1 91.12,13.33 89.53,11.75 84.46,11.75 83.19,13.02 JOYSTICK.3
N$28
  Bottom 0.61: R5.1 JOYSTICK.4
N$29
  Bottom 0.813: LED3.A 8.89,75.25 10.16,76.52 R46.1
N$30
  Bottom 0.813: X2.1 10.19,62.89 17.46,70.17 17.46,73.33 IC2.3
N$37
  Bottom 0.813: OK9.1 R42.1
N$38
  Bottom 1.016: OK10.1 R43.1
N$39
  Bottom 1.016: OK11.1 R44.1
N$40
  Bottom 0.813: OK12.1 R45.1
PB1
  Bottom 0.61: TOMBOL.1 PCB1.36
PB2
  Bottom 0.61: PCB1.38 TOMBOL.2
PB3
  Bottom 0.508: 97.79,36.2 84.77,36.2
  Bottom 0.61: PCB1.37 97.79,36.2 | 84.77,36.2 TOMBOL.3
PB4
  Bottom 0.508: 97.79,33.66 84.77,33.66
  Bottom 0.61: PCB1.39 97.79,33.66 | 84.77,33.66 TOMBOL.4
PB5
  Bottom 0.61: TOMBOL.5 82.23,36.2 82.23,33.34 82.87,32.7 94.93,32.7 95.25,32.39 PCB1.40
PB6
  Bottom 0.508: 97.79,31.11 95.25,31.11
  Bottom 0.61: PCB1.41 97.79,31.11 | TOMBOL.6 80.96,33.34 82.55,31.75 94.62,31.75 95.25,31.11
PN1
  Bottom 0.508: 61.28,36.2 61.28,33.34
  Bottom 0.61: PN1-4.5 61.28,36.2 | 61.28,33.34 63.5,31.11 67.94,31.11 73.98,25.08 89.22,25.08 89.53,24.76 PCB1.46
PN2
  Bottom 0.508: 88.27,23.49 97.79,23.49
  Bottom 0.61: PN1-4.6 60.01,33.34 63.18,30.16 67.63,30.16 73.66,24.13 87.63,24.13 88.27,23.49 | 97.79,23.49 PCB1.47
PN3
  Bottom 0.508: 58.74,36.2 58.74,33.02
  Bottom 0.61: PN1-4.7 58.74,36.2 | 58.74,33.02 62.55,29.21 67.31,29.21 73.34,23.18 86.68,23.18 87.63,22.22 PCB1.48
PN4
  Bottom 0.508: 94.93,20.95 97.79,20.95
  Bottom 0.61: PN1-4.8 57.47,33.02 62.23,28.26 66.68,28.26 72.71,22.22 85.72,22.22 86.68,21.27 94.62,21.27 94.93,20.95 | 97.79,20.95 PCB1.49
PN5
  Bottom 0.61: PN1-4.1 71.12,37.47 72.39,36.2 72.39,32.39 75.88,28.89 86.36,28.89 87.31,29.85 PCB1.42
PN6
  Bottom 0.508: 88.27,28.57 97.79,28.57
  Bottom 0.61: PN1-4.2 70.17,34.93 71.12,33.97 71.12,32.39 75.56,27.94 87.63,27.94 88.27,28.57 | 97.79,28.57 PCB1.43
PN7
  Bottom 0.508: 63.82,36.2 63.82,33.66
  Bottom 0.61: PN1-4.3 63.82,36.2 | 63.82,33.66 64.45,33.02 69.22,33.02 75.25,26.99 88.9,26.99 89.22,27.3 PCB1.44
PN8
  Bottom 0.508: 74.61,26.04 97.79,26.04
  Bottom 0.61: PN1-4.4 62.55,33.34 63.82,32.07 68.58,32.07 74.61,26.04 | 97.79,26.04 PCB1.45
PWM1
  Bottom 0.813: R19.2 33.65,61.91 35.24,60.32 40,60.32 41.59,58.74 41.59,57.85 PCB1.9
PWM1'  (via drill 0.8 pad 1.27)
  Top 0.61: v36.2,85.72 v36.2,74.3
  Bottom 0.51: 125.09,79.06 144.78,79.06
  Bottom 0.61: v36.2,85.72 118.43,85.72 125.09,79.06 | v36.2,74.3 OK2.3 | -.4 145.1,78.74 | 145.1,78.74 -.3 | 144.78,79.06 145.1,78.74
  Bottom 0.813: OK2.3 34.29,72.71 R15.2
PWM2
  Bottom 0.813: R32.2 41.59,62.55 44.13,60.01 44.13,57.85 PCB1.8
PWM2'  (via drill 0.8 pad 1.27)
  Top 0.61: v43.18,84.45 v43.18,74.3
  Bottom 0.51: 132.4,65.41 145.1,65.41
  Bottom 0.61: ..4 145.1,65.41 ..3 | R28.2 OK7.3 v43.18,74.3 | v43.18,84.45 118.11,84.45 131.44,71.12 131.44,66.36 132.4,65.41
PWM3
  Bottom 0.813: R45.2 48.26,60.64 PCB1.7
PWM3'  (via drill 0.8 pad 1.27)
  Top 0.61: v51.12,83.19 v51.12,74.3
  Bottom 0.51: 132.08,51.44 145.1,51.44
  Bottom 0.61: =.4 145.1,51.44 =.3 | R41.2 OK12.3 v51.12,74.3 | v51.12,83.19 118.11,83.19 130.49,70.8 130.49,53.02 132.08,51.44
PWM4
  Bottom 0.813: R42.2 51.75,60.96 50.8,59.38 PCB1.6
PWM4'  (via drill 0.8 pad 1.27)
  Top 0.61: v58.1,81.91 v58.1,74.3
  Bottom 0.51: 130.81,36.51 144.78,36.51
  Bottom 0.61: ,.4 145.1,36.2 | 145.1,36.2 ,.3 | R38.2 OK9.3 v58.1,74.3 | v58.1,81.91 118.11,81.91 129.54,70.48 129.54,37.78 130.81,36.51 | 144.78,36.51 145.1,36.2
RST  (via drill 0.8 pad 1.27)
  Top 0.813: v41.59,41.59 v30.8,41.59
  Bottom 0.61: TOMBOL.7 78.42,38.1 74.93,41.59 50.8,41.59
  Bottom 0.813: PCB1.RESET 28.58,16.51 28.58,27.3 | 28.58,27.3 32.7,31.43 32.7,34.14 RESET.3 32.7,34.24 32.7,39.69 v30.8,41.59 | JP3.1 28.58,27.3 | 50.8,41.59 v41.59,41.59
RX
  Bottom 0.813: UART1.1 79.38,61.6 79.38,61.28 78.74,60.64 PCB1.17
SCK
  Bottom 0.61: PCB1.52 94.3,17.14 93.03,15.87 R4.2
SCL
  Bottom 0.61: I2C.1 22.54,61.91 21.27,60.64 21.27,57.85 PCB1.SCL1
SDA
  Bottom 0.61: PCB1.SDA1 23.88,57.85 26.03,60.01 26.03,63.18 24.77,64.45 I2C.2
SEN1
  Bottom 0.61: X3.1 49.53,13.33 PCB1.A0
SEN2  (via drill 0.8 pad 1.27)
  Top 0.61: v52.71,13.02 v52.71,21.27
  Bottom 0.61: PCB1.A1 55.88,9.84 v52.71,13.02 | v52.71,21.27 X4.1
SEN3
  Bottom 0.61: PCB1.A2 58.42,12.06 X5.1
SEN4  (via drill 0.8 pad 1.27)
  Top 0.61: v60.96,13.33 v60.96,21.27
  Bottom 0.61: PCB1.A3 v60.96,13.33 | v60.96,21.27 X6.1
SEN5
  Bottom 0.61: PCB1.A4 63.5,11.43 X7.1
SEN6  (via drill 0.8 pad 1.27)
  Top 0.61: v67.94,12.38 v67.94,21.27
  Bottom 0.61: PCB1.A5 66.04,10.48 v67.94,12.38 | v67.94,21.27 X8.1
SS  (via drill 0.8 pad 1.27)
  Top 0.61: v73.98,9.84 v73.98,19.37
  Bottom 0.508: 97.79,15.88 97.79,10.16
  Bottom 0.61: PCB1.53 97.79,15.88 | 97.79,10.16 94.93,7.3 74.61,7.3 73.98,7.94 v73.98,9.84 | v73.98,19.37 R5.2
TX
  Bottom 0.813: UART1.2 78.1,64.13 76.2,62.23 PCB1.16
(copper drawn outside any net)
  shapes: Top area x911